# EAGLE schematic p2s (EAGLE 8.0.2)
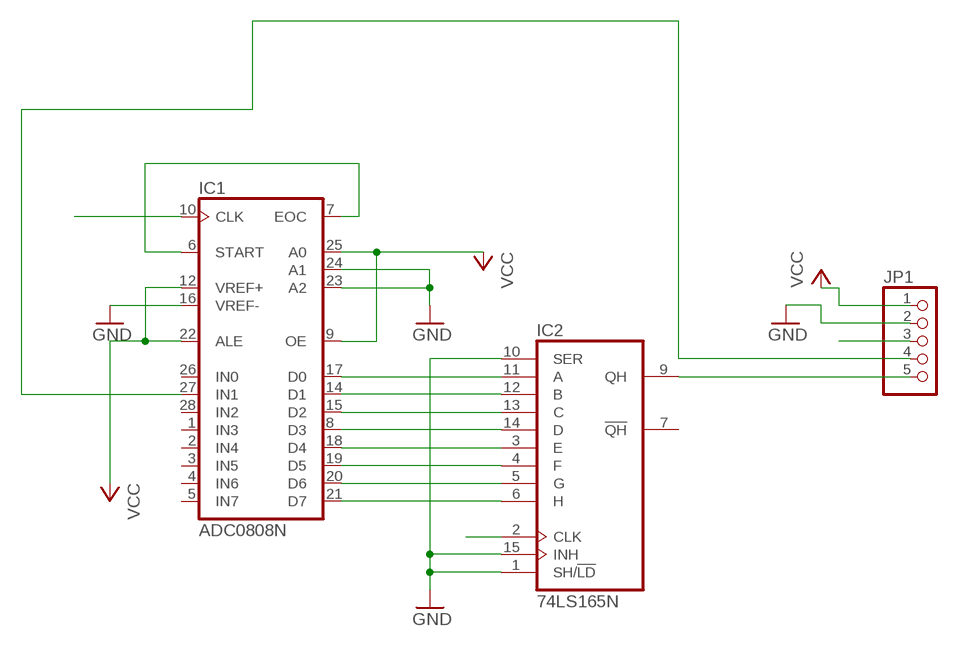
[diagram p0: schematic, sheet 1]

## Parts
IC1  ADC0808N  [DIL28-6]
IC2  74LS165N  [DIL16]
JP1  PINHD-1X5  [1X05]

## Nets
CLK: IC1.10(CLK) IC2.2(CLK) JP1.3
GND: IC1.16(VREF-) IC1.23(A2) IC1.24(A1) IC2.1(SH/!LD) IC2.10(SER) IC2.15(INH) JP1.2
N$2: IC2.9(QH) JP1.5
N$5: IC1.27(IN1) JP1.4
N$6: IC1.6(START) IC1.7(EOC)
N$7: IC1.17(D0) IC2.11(A)
N$8: IC1.14(D1) IC2.12(B)
N$9: IC1.15(D2) IC2.13(C)
N$10: IC1.8(D3) IC2.14(D)
N$11: IC1.18(D4) IC2.3(E)
N$12: IC1.19(D5) IC2.4(F)
N$13: IC1.20(D6) IC2.5(G)
N$14: IC1.21(D7) IC2.6(H)
VCC: IC1.9(OE) IC1.12(VREF+) IC1.22(ALE) IC1.25(A0) JP1.1
Unconnected: IC1.1(IN3) IC1.2(IN4) IC1.3(IN5) IC1.4(IN6) IC1.5(IN7) IC1.26(IN0) IC1.28(IN2) IC2.7(!QH)

## Power pins joined to a net without a drawn wire
GND: IC1.13(GND) IC2.8(GND)
VCC: IC1.11(VCC) IC2.16(VCC)

## Library data of the parts
IC1 = linear:ADC0808: 8-bit A/D CONVERTER with 8-channel multiplexer
IC2 = 74xx-eu:74*165: 8-bit parallel load SHIFT REGISTER
JP1 = pinhead:PINHD-1X5: PIN HEADER